# Altium schematic sheet Triacs.SchDoc
size A4
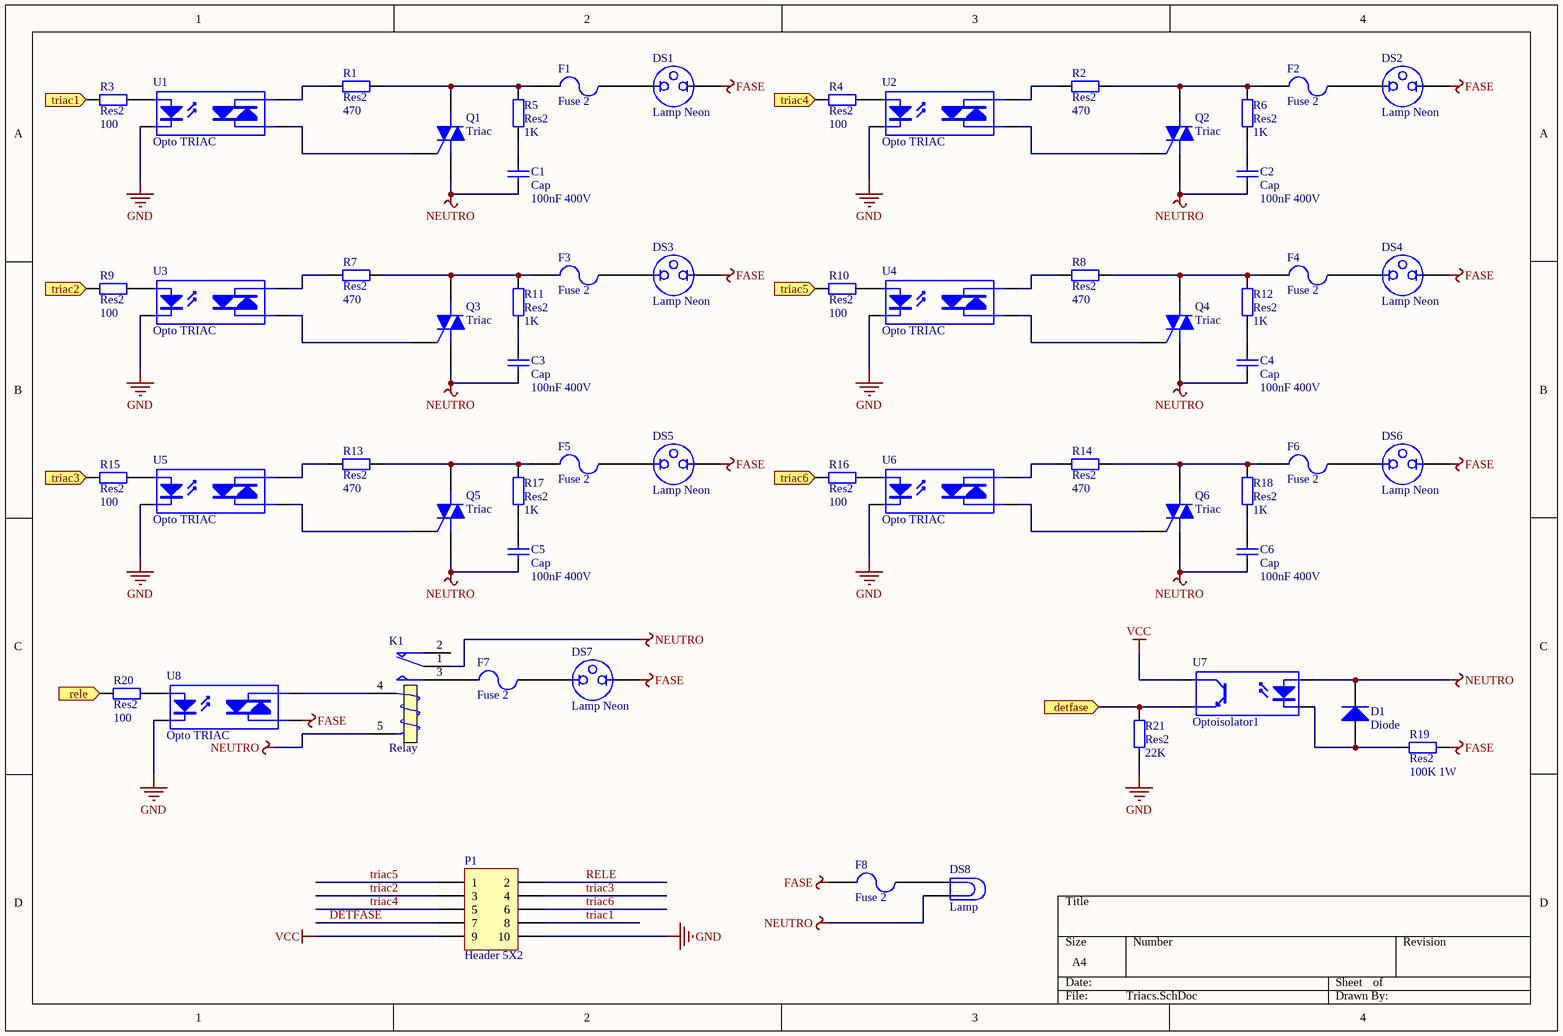
[diagram p0: Triacs.SchDoc]

## Parts
C1  Cap  value 100nF 400V  [RAD-0.3]
C2  Cap  value 100nF 400V  [RAD-0.3]
C3  Cap  value 100nF 400V  [RAD-0.3]
C4  Cap  value 100nF 400V  [RAD-0.3]
C5  Cap  value 100nF 400V  [RAD-0.3]
C6  Cap  value 100nF 400V  [RAD-0.3]
D1  Diode  [AXIAL-0.3]
DS1  Lamp Neon  [PIN2]
DS2  Lamp Neon  [PIN2]
DS3  Lamp Neon  [PIN2]
DS4  Lamp Neon  [PIN2]
DS5  Lamp Neon  [PIN2]
DS6  Lamp Neon  [PIN2]
DS7  Lamp Neon  [PIN2]
DS8  Lamp  [PIN2]
F1  Fuse 2  [PIN-W2/E2.8]
F2  Fuse 2  [PIN-W2/E2.8]
F3  Fuse 2  [PIN-W2/E2.8]
F4  Fuse 2  [PIN-W2/E2.8]
F5  Fuse 2  [PIN-W2/E2.8]
F6  Fuse 2  [PIN-W2/E2.8]
F7  Fuse 2  [PIN-W2/E2.8]
F8  Fuse 2  [PIN-W2/E2.8]
K1  Relay  [MODULE5B]
P1  Header 5X2  [HDR2X5]
Q1  Triac  [369-03]
Q2  Triac  [369-03]
Q3  Triac  [369-03]
Q4  Triac  [369-03]
Q5  Triac  [369-03]
Q6  Triac  [369-03]
R1  Res2  value 470  [AXIAL-0.4]
R2  Res2  value 470  [AXIAL-0.4]
R3  Res2  value 100  [AXIAL-0.4]
R4  Res2  value 100  [AXIAL-0.4]
R5  Res2  value 1K  [AXIAL-0.4]
R6  Res2  value 1K  [AXIAL-0.4]
R7  Res2  value 470  [AXIAL-0.4]
R8  Res2  value 470  [AXIAL-0.4]
R9  Res2  value 100  [AXIAL-0.4]
R10  Res2  value 100  [AXIAL-0.4]
R11  Res2  value 1K  [AXIAL-0.4]
R12  Res2  value 1K  [AXIAL-0.4]
R13  Res2  value 470  [AXIAL-0.4]
R14  Res2  value 470  [AXIAL-0.4]
R15  Res2  value 100  [AXIAL-0.4]
R16  Res2  value 100  [AXIAL-0.4]
R17  Res2  value 1K  [AXIAL-0.4]
R18  Res2  value 1K  [AXIAL-0.4]
R19  Res2  value 100K 1W  [Resis1W]
R20  Res2  value 100  [AXIAL-0.4]
R21  Res2  value 22K  [AXIAL-0.4]
U1  Opto TRIAC  [DIP-6]
U2  Opto TRIAC  [DIP-6]
U3  Opto TRIAC  [DIP-6]
U4  Opto TRIAC  [DIP-6]
U5  Opto TRIAC  [DIP-6]
U6  Opto TRIAC  [DIP-6]
U7  Optoisolator1  [DIP-6]
U8  Opto TRIAC  [DIP-6]

## Ports
detfase (in), rele (in), triac1 (in), triac2 (in), triac3 (in), triac4 (in), triac5 (in), triac6 (in)

## Nets
FASE: DS1.2 DS2.2 DS3.2 DS4.2 DS5.2 DS6.2 DS7.2 F8.1 R19.2 U8.6(A/K)
GND: P1.10 R21.1 U1.2(K) U2.2(K) U3.2(K) U4.2(K) U5.2(K) U6.2(K) U8.2(K)
NEUTRO: C1.1 C2.1 C3.1 C4.1 C5.1 C6.1 D1.2(K) DS8.2 K1.1(COM) K1.5(T2) Q1.1(M1) Q2.1(M1) Q3.1(M1) Q4.1(M1) Q5.1(M1) Q6.1(M1) U7.1(A)
VCC: P1.9 U7.5(C)
detfase: R21.2 U7.4(E) ; port detfase
DETFASE: P1.7  [a separate net that carries the same name]
rele: R20.1 ; port rele
RELE: P1.2  [a separate net that carries the same name]
triac1: R3.1 ; port triac1
triac1: P1.8  [a separate net that carries the same name]
triac2: P1.3
triac2: R9.1 ; port triac2  [a separate net that carries the same name]
triac3: P1.4
triac3: R15.1 ; port triac3  [a separate net that carries the same name]
triac4: P1.5
triac4: R4.1 ; port triac4  [a separate net that carries the same name]
triac5: P1.1
triac5: R10.1 ; port triac5  [a separate net that carries the same name]
triac6: P1.6
triac6: R16.1 ; port triac6  [a separate net that carries the same name]
NetC1_2: C1.2 R5.1
NetC2_2: C2.2 R6.1
NetC3_2: C3.2 R11.1
NetC4_2: C4.2 R12.1
NetC5_2: C5.2 R17.1
NetC6_2: C6.2 R18.1
NetD1_1: D1.1(A) R19.1 U7.2(K)
NetDS1_1: DS1.1 F1.2
NetDS2_1: DS2.1 F2.2
NetDS3_1: DS3.1 F3.2
NetDS4_1: DS4.1 F4.2
NetDS5_1: DS5.1 F5.2
NetDS6_1: DS6.1 F6.2
NetDS7_1: DS7.1 F7.2
NetDS8_1: DS8.1 F8.2
NetF1_1: F1.1 Q1.2(M2) R1.2 R5.2
NetF2_1: F2.1 Q2.2(M2) R2.2 R6.2
NetF3_1: F3.1 Q3.2(M2) R7.2 R11.2
NetF4_1: F4.1 Q4.2(M2) R8.2 R12.2
NetF5_1: F5.1 Q5.2(M2) R13.2 R17.2
NetF6_1: F6.1 Q6.2(M2) R14.2 R18.2
NetF7_1: F7.1 K1.3(NO)
NetK1_4: K1.4(T1) U8.4(A/K)
NetQ1_3: Q1.3(G) U1.6(A/K)
NetQ2_3: Q2.3(G) U2.6(A/K)
NetQ3_3: Q3.3(G) U3.6(A/K)
NetQ4_3: Q4.3(G) U4.6(A/K)
NetQ5_3: Q5.3(G) U5.6(A/K)
NetQ6_3: Q6.3(G) U6.6(A/K)
NetR1_1: R1.1 U1.4(A/K)
NetR2_1: R2.1 U2.4(A/K)
NetR3_2: R3.2 U1.1(A)
NetR4_2: R4.2 U2.1(A)
NetR7_1: R7.1 U3.4(A/K)
NetR8_1: R8.1 U4.4(A/K)
NetR9_2: R9.2 U3.1(A)
NetR10_2: R10.2 U4.1(A)
NetR13_1: R13.1 U5.4(A/K)
NetR14_1: R14.1 U6.4(A/K)
NetR15_2: R15.2 U5.1(A)
NetR16_2: R16.2 U6.1(A)
NetR20_2: R20.2 U8.1(A)

Not connected (* = marked no-connect by the designer): K1 2(NC)

## Library data of the parts
C1-C6 = Cap: Capacitor; Published: 8-Jun-2000; LatestRevisionDate: 17-Jul-2002; LatestRevisionNote: Re-released for DXP Platform.; PackageReference: RAD-0.3; Publisher: Altium Limited
D1 = Diode: Default Diode; Published: 8-Jun-2000; LatestRevisionDate: 17-Jul-2002; LatestRevisionNote: Re-released for DXP Platform.; PackageDocument: Sep-1996; PackageReference: SMC; Publisher: Altium Limited; Code_JEDEC: DO-214-AB
DS1-DS7 = Lamp Neon: Neon Lamp; Published: 24-Mar-1999; LatestRevisionDate: 17-Jul-2002; LatestRevisionNote: Re-released for DXP Platform.; PackageReference: PIN2; Publisher: Altium Limited
DS8 = Lamp: Incandescent Bulb; Published: 24-Mar-1999; LatestRevisionDate: 17-Jul-2002; LatestRevisionNote: Re-released for DXP Platform.; PackageReference: PIN2; Publisher: Altium Limited
F1-F8 = Fuse 2: Fuse; Published: 8-Jun-2000; LatestRevisionDate: 17-Jul-2002; LatestRevisionNote: Re-released for DXP Platform.; PackageReference: PIN-W2/E2.8; Publisher: Altium Limited
K1 = Relay: SPDT Relay; Published: 8-Jun-2000; LatestRevisionDate: 17-Jul-2002; LatestRevisionNote: Re-released for DXP Platform.; PackageReference: MODULE5B; Publisher: Altium Limited
P1 = Header 5X2: Header, 5-Pin, Dual row; LatestRevisionDate: 17-Jul-2002; LatestRevisionNote: Re-released for DXP Platform.; Publisher: Altium Limited
Q1-Q6 = Triac: Silicon Bidirectional Triode Thyristor; Note: Pin 2 is electrically connected to Pin 4 (TAB); Published: 29-Sep-2000; LatestRevisionDate: 17-Jul-2002; LatestRevisionNote: Re-released for DXP Platform.; DatasheetDocument: 1999; PackageReference: 369-03; Publisher: Altium Limited; Code_JEDEC: TO-251-AA; ComponentLink1Description: Manufacturer Link; ComponentLink1URL: http://www.motorola.com/
R1-R21 = Res2: Resistor; Published: 8-Jun-2000; LatestRevisionDate: 17-Jul-2002; LatestRevisionNote: Re-released for DXP Platform.; PackageReference: AXIAL-0.4; Publisher: Altium Limited
U1-U6 U8 = Opto TRIAC: Opto-Triac; Published: 24-Mar-1999; LatestRevisionDate: 17-Jul-2002; LatestRevisionNote: Re-released for DXP Platform.; PackageReference: NPSIP4A; Publisher: Altium Limited
U7 = Optoisolator1: 4-Pin Phototransistor Optocoupler; Published: 24-Mar-1999; LatestRevisionDate: 04-Mar-2005; LatestRevisionNote: Sch pins 3 & 4 Swapped.; DatasheetDocument: Nov-2003; PackageReference: DIP-4; Publisher: Altium Limited